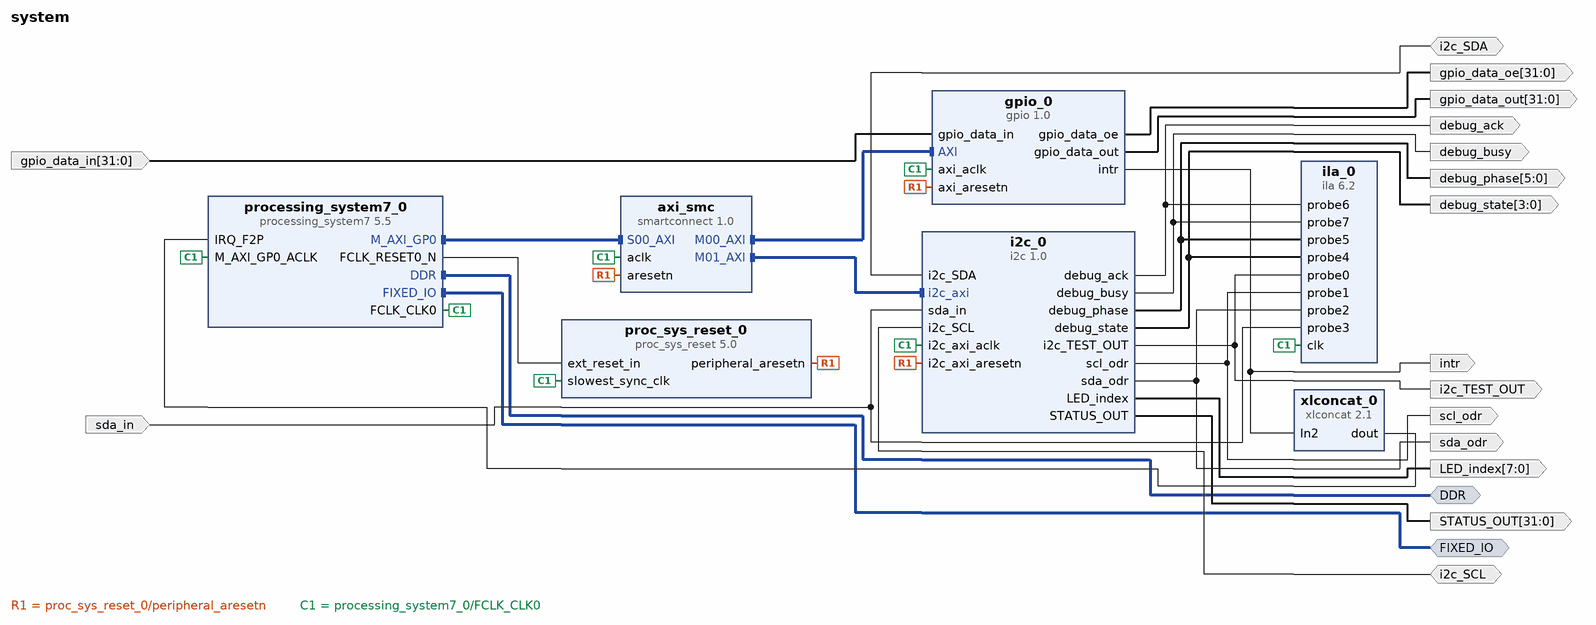
[diagram p0: block diagram of the top level]
# Vivado block design system, xc7z007sclg400-1, Vivado 2025.1
create_bd_design system

create_bd_intf_port -mode Master -vlnv xilinx.com:interface:ddrx_rtl:1.0 DDR
create_bd_intf_port -mode Master -vlnv xilinx.com:display_processing_system7:fixedio_rtl:1.0 FIXED_IO
create_bd_port -dir O -type intr intr
create_bd_port -dir I -from 31 -to 0 gpio_data_in
create_bd_port -dir O -from 31 -to 0 gpio_data_out
create_bd_port -dir O -from 31 -to 0 gpio_data_oe
create_bd_port -dir O -from 31 -to 0 STATUS_OUT
create_bd_port -dir O -from 7 -to 0 LED_index
create_bd_port -dir O i2c_TEST_OUT
create_bd_port -dir IO i2c_SDA
create_bd_port -dir IO i2c_SCL
create_bd_port -dir O scl_odr
create_bd_port -dir I sda_in
create_bd_port -dir O sda_odr
create_bd_port -dir O -from 5 -to 0 debug_phase
create_bd_port -dir O -from 3 -to 0 debug_state
create_bd_port -dir O debug_ack
create_bd_port -dir O debug_busy

create_bd_cell -type ip -vlnv xilinx.com:ip:processing_system7:5.5 processing_system7_0
set_property -dict [list \
  CONFIG.PCW_EN_CLK1_PORT 1 \
  CONFIG.PCW_FCLK_CLK1_BUF TRUE \
  CONFIG.PCW_FPGA0_PERIPHERAL_FREQMHZ 100 \
  CONFIG.PCW_FPGA1_PERIPHERAL_FREQMHZ 3.072 \
  CONFIG.PCW_FPGA_FCLK1_ENABLE 1 \
  CONFIG.PCW_GPIO_MIO_GPIO_ENABLE 1 \
  CONFIG.PCW_GPIO_MIO_GPIO_IO MIO \
  CONFIG.PCW_I2C1_I2C1_IO {MIO 20 .. 21} \
  CONFIG.PCW_I2C1_PERIPHERAL_ENABLE 1 \
  CONFIG.PCW_I2C_PERIPHERAL_FREQMHZ 111.111115 \
  CONFIG.PCW_I2C_RESET_ENABLE 1 \
  CONFIG.PCW_I2C_RESET_SELECT {Share reset pin} \
  CONFIG.PCW_IRQ_F2P_INTR 1 \
  CONFIG.PCW_QSPI_GRP_FBCLK_ENABLE 1 \
  CONFIG.PCW_QSPI_GRP_FBCLK_IO {MIO 8} \
  CONFIG.PCW_QSPI_GRP_SINGLE_SS_ENABLE 1 \
  CONFIG.PCW_QSPI_GRP_SINGLE_SS_IO {MIO 1 .. 6} \
  CONFIG.PCW_QSPI_PERIPHERAL_ENABLE 1 \
  CONFIG.PCW_QSPI_QSPI_IO {MIO 1 .. 6} \
  CONFIG.PCW_SD0_GRP_CD_ENABLE 1 \
  CONFIG.PCW_SD0_GRP_CD_IO {MIO 47} \
  CONFIG.PCW_SD0_GRP_WP_ENABLE 0 \
  CONFIG.PCW_SD0_PERIPHERAL_ENABLE 1 \
  CONFIG.PCW_SD0_SD0_IO {MIO 40 .. 45} \
  CONFIG.PCW_SDIO_PERIPHERAL_FREQMHZ 100 \
  CONFIG.PCW_SINGLE_QSPI_DATA_MODE x4 \
  CONFIG.PCW_SPI1_PERIPHERAL_ENABLE 1 \
  CONFIG.PCW_SPI1_SPI1_IO {MIO 10 .. 15} \
  CONFIG.PCW_UART0_PERIPHERAL_ENABLE 1 \
  CONFIG.PCW_UART0_UART0_IO {MIO 14 .. 15} \
  CONFIG.PCW_UART1_PERIPHERAL_ENABLE 1 \
  CONFIG.PCW_UART1_UART1_IO {MIO 48 .. 49} \
  CONFIG.PCW_UART_PERIPHERAL_FREQMHZ 100 \
  CONFIG.PCW_UIPARAM_DDR_BUS_WIDTH {16 Bit} \
  CONFIG.PCW_UIPARAM_DDR_MEMORY_TYPE {DDR 3 (Low Voltage)} \
  CONFIG.PCW_UIPARAM_DDR_PARTNO Custom \
  CONFIG.PCW_USB0_PERIPHERAL_ENABLE 1 \
  CONFIG.PCW_USB0_RESET_ENABLE 1 \
  CONFIG.PCW_USB0_RESET_IO {MIO 46} \
  CONFIG.PCW_USB0_USB0_IO {MIO 28 .. 39} \
  CONFIG.PCW_USB_RESET_ENABLE 1 \
  CONFIG.PCW_USB_RESET_SELECT {Share reset pin} \
  CONFIG.PCW_USE_FABRIC_INTERRUPT 1 \
] [get_bd_cells processing_system7_0]
# 231 more settings of processing_system7_0 are not shown: defaults, MIO pin electricals, DDR timing, and values the tool derives
create_bd_cell -type ip -vlnv xilinx.com:ip:proc_sys_reset:5.0 proc_sys_reset_0
create_bd_cell -type ip -vlnv xilinx.com:user:gpio:1.0 gpio_0
create_bd_cell -type ip -vlnv xilinx.com:ip:smartconnect:1.0 axi_smc
set_property -dict {CONFIG.NUM_MI 2 CONFIG.NUM_SI 1} [get_bd_cells axi_smc]
create_bd_cell -type ip -vlnv xilinx.com:ip:xlconcat:2.1 xlconcat_0
set_property -dict {CONFIG.NUM_PORTS 3} [get_bd_cells xlconcat_0]
create_bd_cell -type ip -vlnv xilinx.com:user:i2c:1.0 i2c_0
create_bd_cell -type ip -vlnv xilinx.com:ip:ila:6.2 ila_0
set_property -dict {CONFIG.C_DATA_DEPTH 8192 CONFIG.C_MONITOR_TYPE Native CONFIG.C_NUM_OF_PROBES 8} [get_bd_cells ila_0]

# ---- connections ----

connect_bd_intf_net [get_bd_intf_pins axi_smc/M00_AXI] [get_bd_intf_pins gpio_0/AXI]
connect_bd_intf_net [get_bd_intf_pins axi_smc/M01_AXI] [get_bd_intf_pins i2c_0/i2c_axi]
connect_bd_intf_net [get_bd_intf_ports DDR] [get_bd_intf_pins processing_system7_0/DDR]
connect_bd_intf_net [get_bd_intf_ports FIXED_IO] [get_bd_intf_pins processing_system7_0/FIXED_IO]
connect_bd_intf_net [get_bd_intf_pins processing_system7_0/M_AXI_GP0] [get_bd_intf_pins axi_smc/S00_AXI]
connect_bd_net [get_bd_ports i2c_SDA] [get_bd_pins i2c_0/i2c_SDA]
connect_bd_net [get_bd_ports i2c_SCL] [get_bd_pins i2c_0/i2c_SCL]
connect_bd_net [get_bd_pins gpio_0/gpio_data_oe] [get_bd_ports gpio_data_oe]
connect_bd_net [get_bd_pins gpio_0/gpio_data_out] [get_bd_ports gpio_data_out]
connect_bd_net [get_bd_pins gpio_0/intr] [get_bd_ports intr] [get_bd_pins xlconcat_0/In2]
connect_bd_net -net gpio_data_in_0_1 [get_bd_ports gpio_data_in] [get_bd_pins gpio_0/gpio_data_in]
connect_bd_net [get_bd_pins i2c_0/LED_index] [get_bd_ports LED_index]
connect_bd_net [get_bd_pins i2c_0/STATUS_OUT] [get_bd_ports STATUS_OUT]
connect_bd_net [get_bd_pins i2c_0/debug_ack] [get_bd_ports debug_ack] [get_bd_pins ila_0/probe6]
connect_bd_net [get_bd_pins i2c_0/debug_busy] [get_bd_ports debug_busy] [get_bd_pins ila_0/probe7]
connect_bd_net [get_bd_pins i2c_0/debug_phase] [get_bd_ports debug_phase] [get_bd_pins ila_0/probe5]
connect_bd_net [get_bd_pins i2c_0/debug_state] [get_bd_ports debug_state] [get_bd_pins ila_0/probe4]
connect_bd_net [get_bd_pins i2c_0/i2c_TEST_OUT] [get_bd_ports i2c_TEST_OUT] [get_bd_pins ila_0/probe0]
connect_bd_net [get_bd_pins i2c_0/scl_odr] [get_bd_ports scl_odr] [get_bd_pins ila_0/probe1]
connect_bd_net [get_bd_pins i2c_0/sda_odr] [get_bd_ports sda_odr] [get_bd_pins ila_0/probe2]
connect_bd_net [get_bd_pins proc_sys_reset_0/peripheral_aresetn] \
  [get_bd_pins gpio_0/axi_aresetn] [get_bd_pins axi_smc/aresetn] [get_bd_pins i2c_0/i2c_axi_aresetn]
connect_bd_net [get_bd_pins processing_system7_0/FCLK_CLK0] \
  [get_bd_pins processing_system7_0/M_AXI_GP0_ACLK] [get_bd_pins axi_smc/aclk] [get_bd_pins gpio_0/axi_aclk] \
  [get_bd_pins proc_sys_reset_0/slowest_sync_clk] [get_bd_pins ila_0/clk] [get_bd_pins i2c_0/i2c_axi_aclk]
connect_bd_net [get_bd_pins processing_system7_0/FCLK_RESET0_N] [get_bd_pins proc_sys_reset_0/ext_reset_in]
connect_bd_net -net sda_in_0_1 [get_bd_ports sda_in] [get_bd_pins ila_0/probe3] [get_bd_pins i2c_0/sda_in]
connect_bd_net [get_bd_pins xlconcat_0/dout] [get_bd_pins processing_system7_0/IRQ_F2P]

# ---- address map ----
assign_bd_address -offset 0x43C00000 -range 64K -target_address_space [get_bd_addr_spaces processing_system7_0/Data] [get_bd_addr_segs gpio_0/AXI/AXI_reg]
assign_bd_address -offset 0x43C20000 -range 64K -target_address_space [get_bd_addr_spaces processing_system7_0/Data] [get_bd_addr_segs i2c_0/i2c_axi/i2c_axi_reg]

validate_bd_design
save_bd_design
